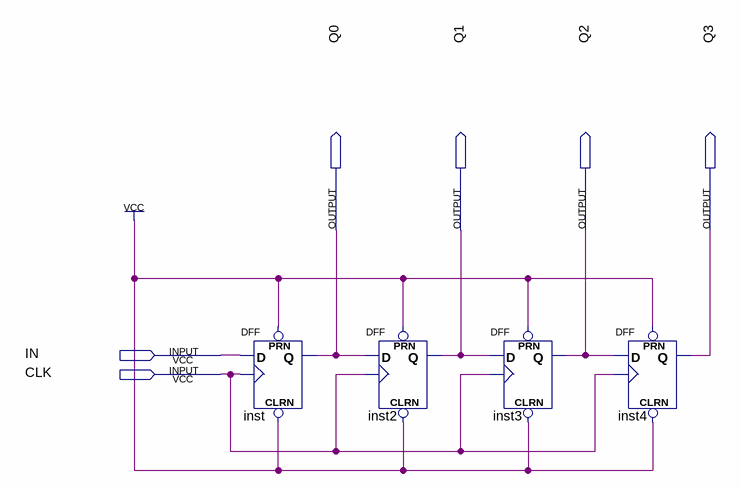
[diagram p0: schematic sheet]
// Quartus schematic lab10step1.bdf as structural Verilog: 4 symbols, 6 pins
module lab10step1 (
  input  IN,
  input  CLK,
  output Q0,
  output Q1,
  output Q2,
  output Q3
);

  DFF inst (.CLRN(1'b1), .CLK(CLK), .D(IN), .PRN(1'b1), .Q(Q0));
  DFF inst2 (.CLRN(1'b1), .CLK(CLK), .D(Q0), .PRN(1'b1), .Q(Q1));
  DFF inst3 (.CLRN(1'b1), .CLK(CLK), .D(Q1), .PRN(1'b1), .Q(Q2));
  DFF inst4 (.CLRN(1'b1), .CLK(CLK), .D(Q2), .PRN(1'b1), .Q(Q3));
endmodule
